# EAGLE design RelayWingTester (EAGLE 9.0.1)
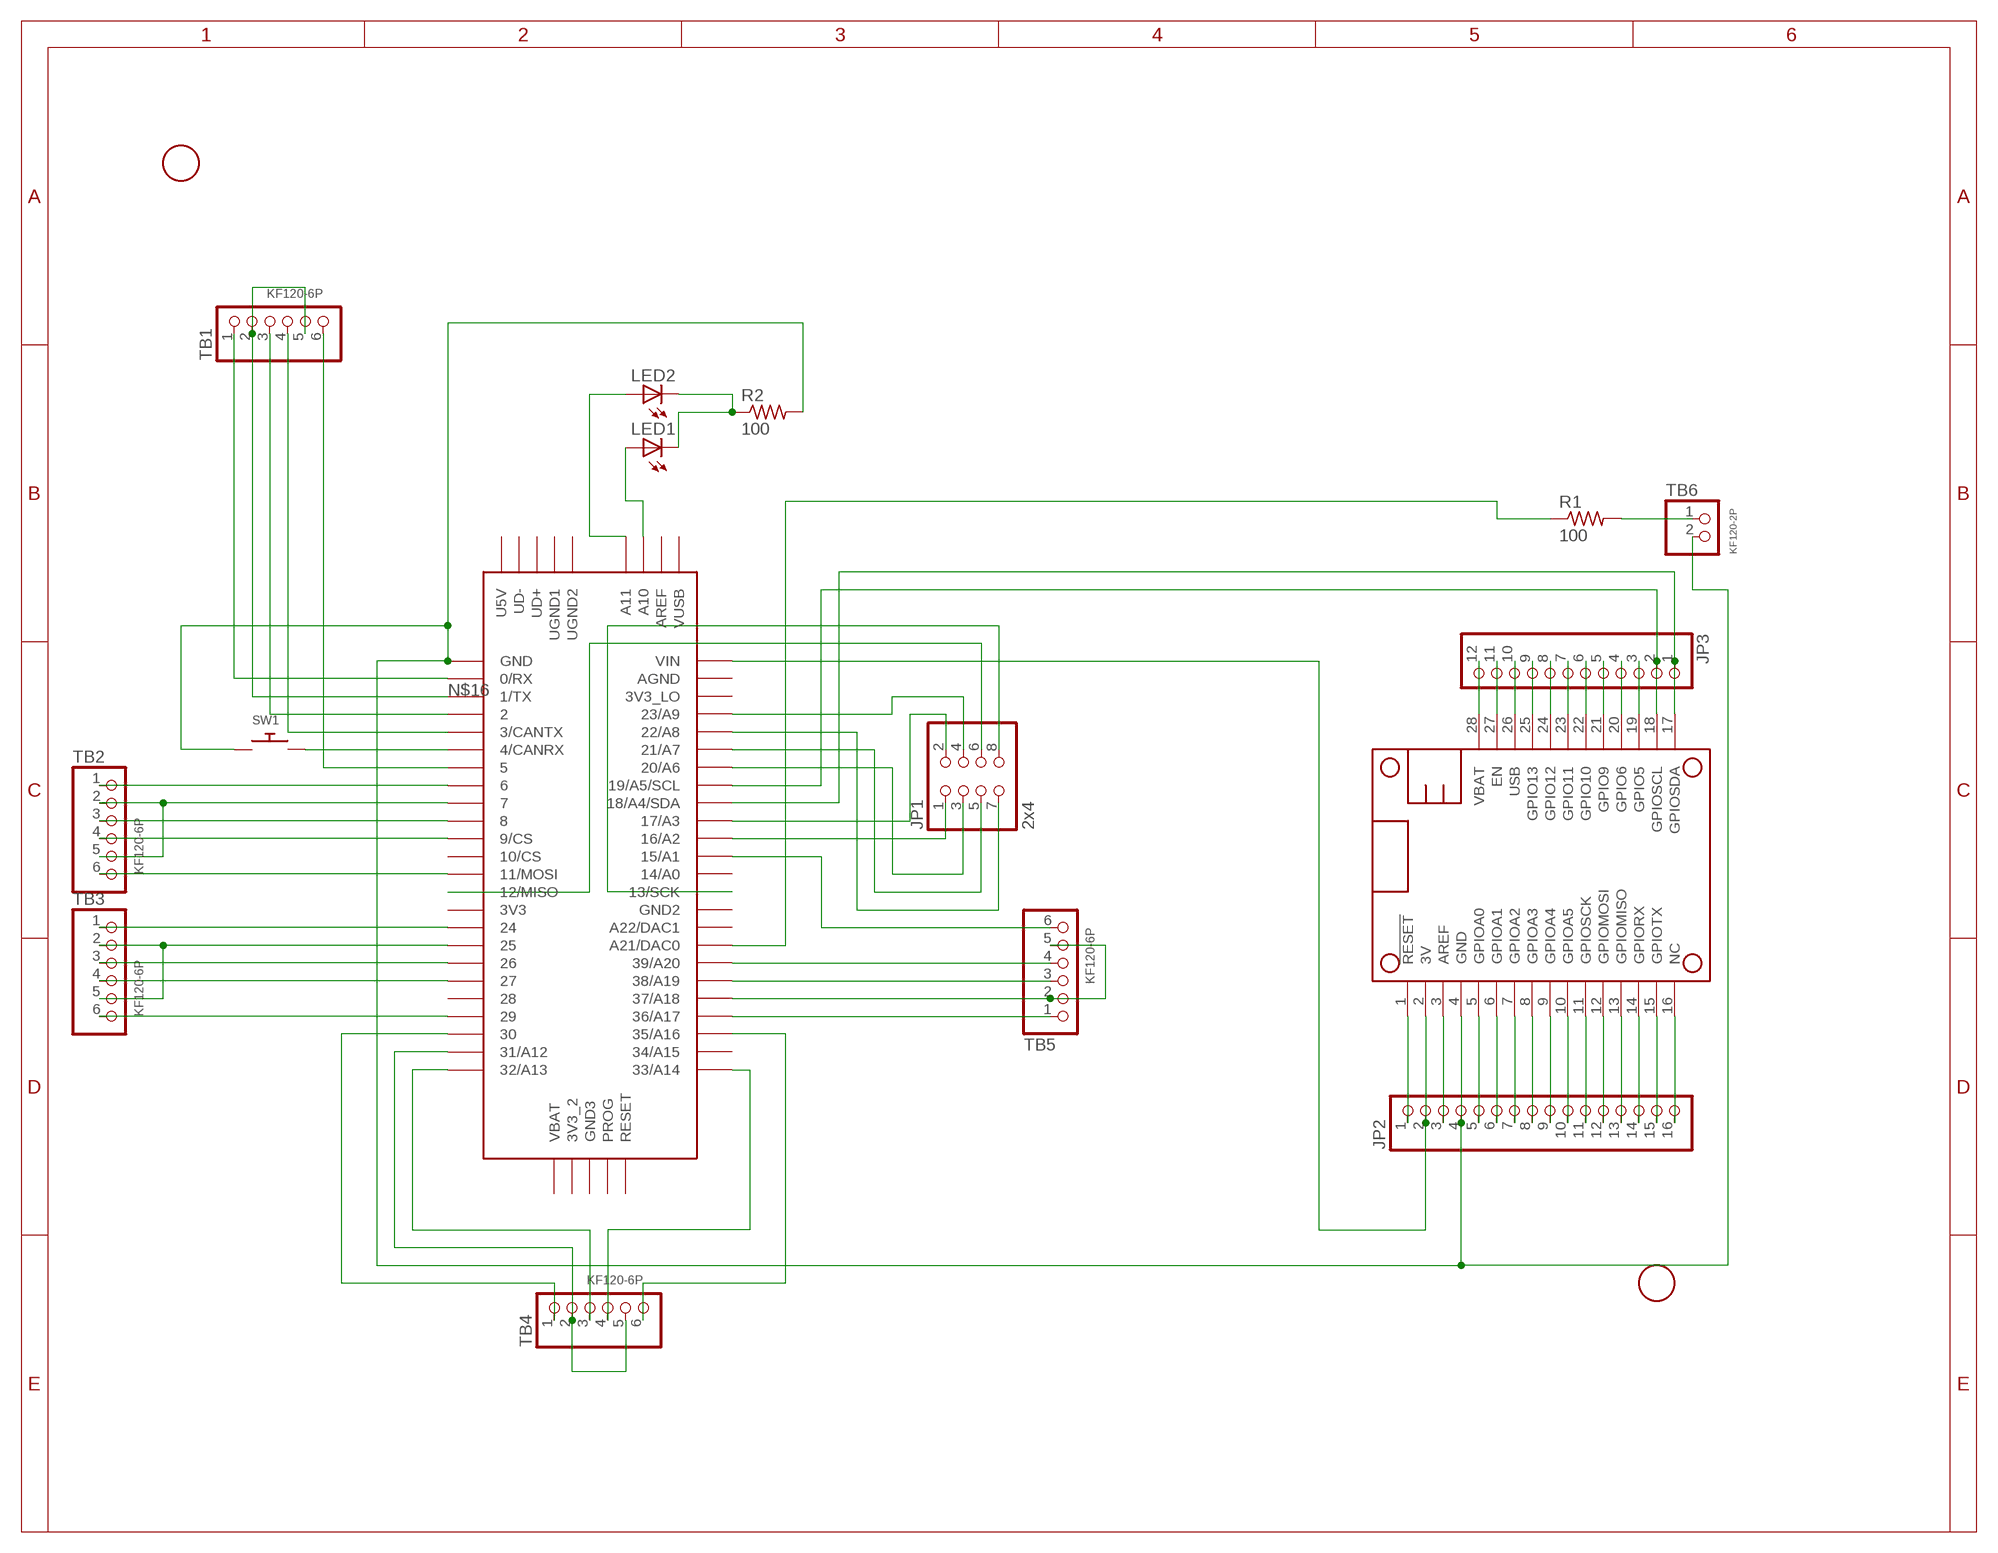
[diagram p0: schematic, sheet 1]

## Parts
JP1  2x4  PINHD-2X4  [2X04]
JP2  PINHD-1X16  [1X16]
JP3  PINHD-1X12  [1X12]
LED1  LED5MM  [LED5MM]
LED2  LED5MM  [LED5MM]
MS1  FEATHERWING_NODIM  [FEATHERWING_DIM]
R1  100  R-US_0207/10  [0207/10]
R2  100  R-US_0207/10  [0207/10]
SW1  SWITCH_PUSHBUTTONSOFTTOUCHSMD_SJ  [PUSHBUTTON_SMD_SJ]
TB1  KF120-6P  [KF120-6P_ROUND]
TB2  KF120-6P  [KF120-6P_ROUND]
TB3  KF120-6P  [KF120-6P_ROUND]
TB4  KF120-6P  [KF120-6P_ROUND]
TB5  KF120-6P  [KF120-6P_ROUND]
TB6  KF120-2P  [KF120-2P_ROUND]
U$2  FIDUCIAL  [FIDUCIAL_1MM]
U$3  FIDUCIAL  [FIDUCIAL_1MM]
U$4  TEENSY_3.5/3.6  [TEENSY_3.5/3.6]

## Nets
3V: JP2.2 MS1.2(3V) U$4.VIN
GND: JP2.4 MS1.4(GND) R2.2 SW1.P$1 TB6.2 U$4.GND
N$1: JP2.3 MS1.3(AREF)
N$2: JP3.1 MS1.17(GPIOSDA) U$4.18/A4/SDA
N$3: JP2.5 MS1.5(GPIOA0)
N$4: JP2.6 MS1.6(GPIOA1)
N$5: JP2.7 MS1.7(GPIOA2)
N$6: JP2.8 MS1.8(GPIOA3)
N$7: JP2.9 MS1.9(GPIOA4)
N$8: JP2.10 MS1.10(GPIOA5)
N$9: JP2.11 MS1.11(GPIOSCK)
N$10: JP2.12 MS1.12(GPIOMOSI)
N$11: JP2.13 MS1.13(GPIOMISO)
N$12: JP2.14 MS1.14(GPIORX)
N$13: JP2.15 MS1.15(GPIOTX)
N$14: JP2.16 MS1.16(NC)
N$15: JP3.3 MS1.19(GPIO5)
N$16: TB1.1 U$4.0/RX
N$17: TB1.2 TB1.5 U$4.1/TX
N$18: JP2.1 MS1.1(!RESET)
N$19: JP3.4 MS1.20(GPIO6)
N$20: JP3.5 MS1.21(GPIO9)
N$21: JP3.6 MS1.22(GPIO10)
N$22: JP3.7 MS1.23(GPIO11)
N$23: JP3.8 MS1.24(GPIO12)
N$24: TB1.3 U$4.2
N$25: TB1.4 U$4.3/CANTX
N$26: SW1.P$2 U$4.4/CANRX
N$27: TB1.6 U$4.5
N$28: TB2.1 U$4.6
N$29: TB2.2 TB2.5 U$4.7
N$30: TB2.3 U$4.8
N$31: TB2.4 U$4.9/CS
N$33: TB2.6 U$4.11/MOSI
N$34: TB3.1 U$4.24
N$35: TB3.2 TB3.5 U$4.25
N$36: TB3.3 U$4.26
N$37: TB3.4 U$4.27
N$39: TB3.6 U$4.29
N$40: TB4.1 U$4.30
N$41: TB4.2 TB4.5 U$4.31/A12
N$42: TB4.3 U$4.32/A13
N$43: TB4.4 U$4.33/A14
N$45: TB4.6 U$4.35/A16
N$46: TB5.1 U$4.36/A17
N$47: TB5.2 TB5.5 U$4.37/A18
N$48: TB5.3 U$4.38/A19
N$49: TB5.4 U$4.39/A20
N$51: JP3.9 MS1.25(GPIO13)
N$52: TB5.6 U$4.15/A1
N$53: R1.1 U$4.21/DAC0(A21/DAC0)
N$54: R1.2 TB6.1
N$55: JP1.1 U$4.16/A2
N$56: JP1.2 U$4.17/A3
N$57: JP1.3 U$4.20/A6
N$58: JP1.5 U$4.21/A7
N$59: JP1.7 U$4.22/A8
N$60: JP1.4 U$4.23/A9
N$61: JP3.11 MS1.27(EN)
N$62: JP1.6 U$4.12/MISO
N$63: JP1.8 U$4.13/SCK
N$64: LED2.A U$4.A11
N$65: LED1.A U$4.A10
N$66: LED1.K(C) LED2.K(C) R2.1
SCL: JP3.2 MS1.18(GPIOSCL) U$4.19/A5/SCL
USB: JP3.10 MS1.26(USB)
VBAT: JP3.12 MS1.28(VBAT)
Unconnected: U$4.3V3 U$4.3V3_2 U$4.3V3_LO U$4.10/CS U$4.14/A0 U$4.28 U$4.34/A15 U$4.A22/DAC1 U$4.AGND U$4.AREF U$4.GND2 U$4.GND3 U$4.PROG U$4.RESET U$4.U5V U$4.UD+ U$4.UD- U$4.UGND1 U$4.UGND2 U$4.VBAT U$4.VUSB

## Library data of the parts
JP1 = pinhead:PINHD-2X4: PIN HEADER
JP2 = pinhead:PINHD-1X16: PIN HEADER
JP3 = pinhead:PINHD-1X12: PIN HEADER
LED1 LED2 = adafruit:LED: LED OSRAM: - CHIPLED LG R971, LG N971, LY N971, LG Q971, LY Q971, LO R971, LY R971 LH N974, LH R974 LS Q976, LO Q976, LY Q976 LO Q996 - Hyper CHIPLED LW Q18S LB Q993, LB Q99A, LB R99A - SideLED LS A670, LO A670, LY A670, LG A670, LP A670 LB A673, LV A673, LT A673, LW A673 LH A674 LY A675 LS A676, LA A676, LO A676, LY A676, LW A676 LS A679, LY A679, LG A679 - Hyper Micro SIDELED® LS Y876, LA Y876, LO Y876, LY Y876 LT Y87S - SmartLED LW L88C, LW L88S LB L89C, LB L89S, LG L890 LS L89K, LO L89K, LY L89K LS L896, LA L896, LO L896, LY L896 - TOPLED LS T670, LO T670, LY T670, LG T670, LP T670 LSG T670, LSP T670, LSY T670, LOP T670, LYG T670 LG T671, LOG T671, LSG T671 LB T673, LV T673, LT T673, LW T673 LH T674 LS T676, LA T676, LO T676, LY T676, LB T676, LH T676, LSB T676, LW T676 LB T67C, LV T67C, LT T67C, LS T67K, LO T67K, LY T67K, LW E67C LS E67B, LA E67B, LO E67B, LY E67B, LB E67C, LV E67C, LT E67C LW T67C LS T679, LY T679, LG T679 LS T770, LO T770, LY T770, LG T770, LP T770 LB T773, LV T773, LT T773, LW T773 LH T774 LS E675, LA E675, LY E675, LS T675 LS T776, LA T776, LO T776, LY T776, LB T776 LHGB T686 LT T68C, LB T68C - Hyper Mini TOPLED® LB M676 - Mini TOPLED Santana® LG M470 LS M47K, LO M47K, LY M47K Source: http://www.osram.convergy.de/
MS1 = microbuilder:FEATHERWING
R1 = resistor:R-US_: RESISTOR, American symbol
R2 = adafruit:R-US_: RESISTOR, American symbol
SW1 = adafruit:SWITCH_PUSHBUTTON: Buttons SOFTTOUCHSMD_SJ - Soft touch temporary push button (Super Junk Akihabara) Compatible with SKPMANE010 [Mouser: 688-SKPMAN] C&K_KSS = Digikey: KSS221GLFS
TB1-TB5 = home:KF120-6P: Kaweei KF120-6P 6-pin screw terminalblock, 0.1" spacing. Adafruit
TB6 = home:KF120-2P: Kaweei KF120-2P 2-pin screw terminal block, 0.1" spacing. Through-hole. Adafruit
U$2 U$3 = adafruit:FIDUCIAL: For use by pick and place machines to calibrate the vision/machine, 1mm By microbuilder.eu
U$4 = Teensy356:TEENSY_3.5/3.6

## Net classes
0 default: width 0.203 mm, clearance 0.203 mm
1 2A: width 0.406 mm, clearance 0.203 mm
2 coils 200mA: width 0.203 mm, clearance 0.203 mm

## Board
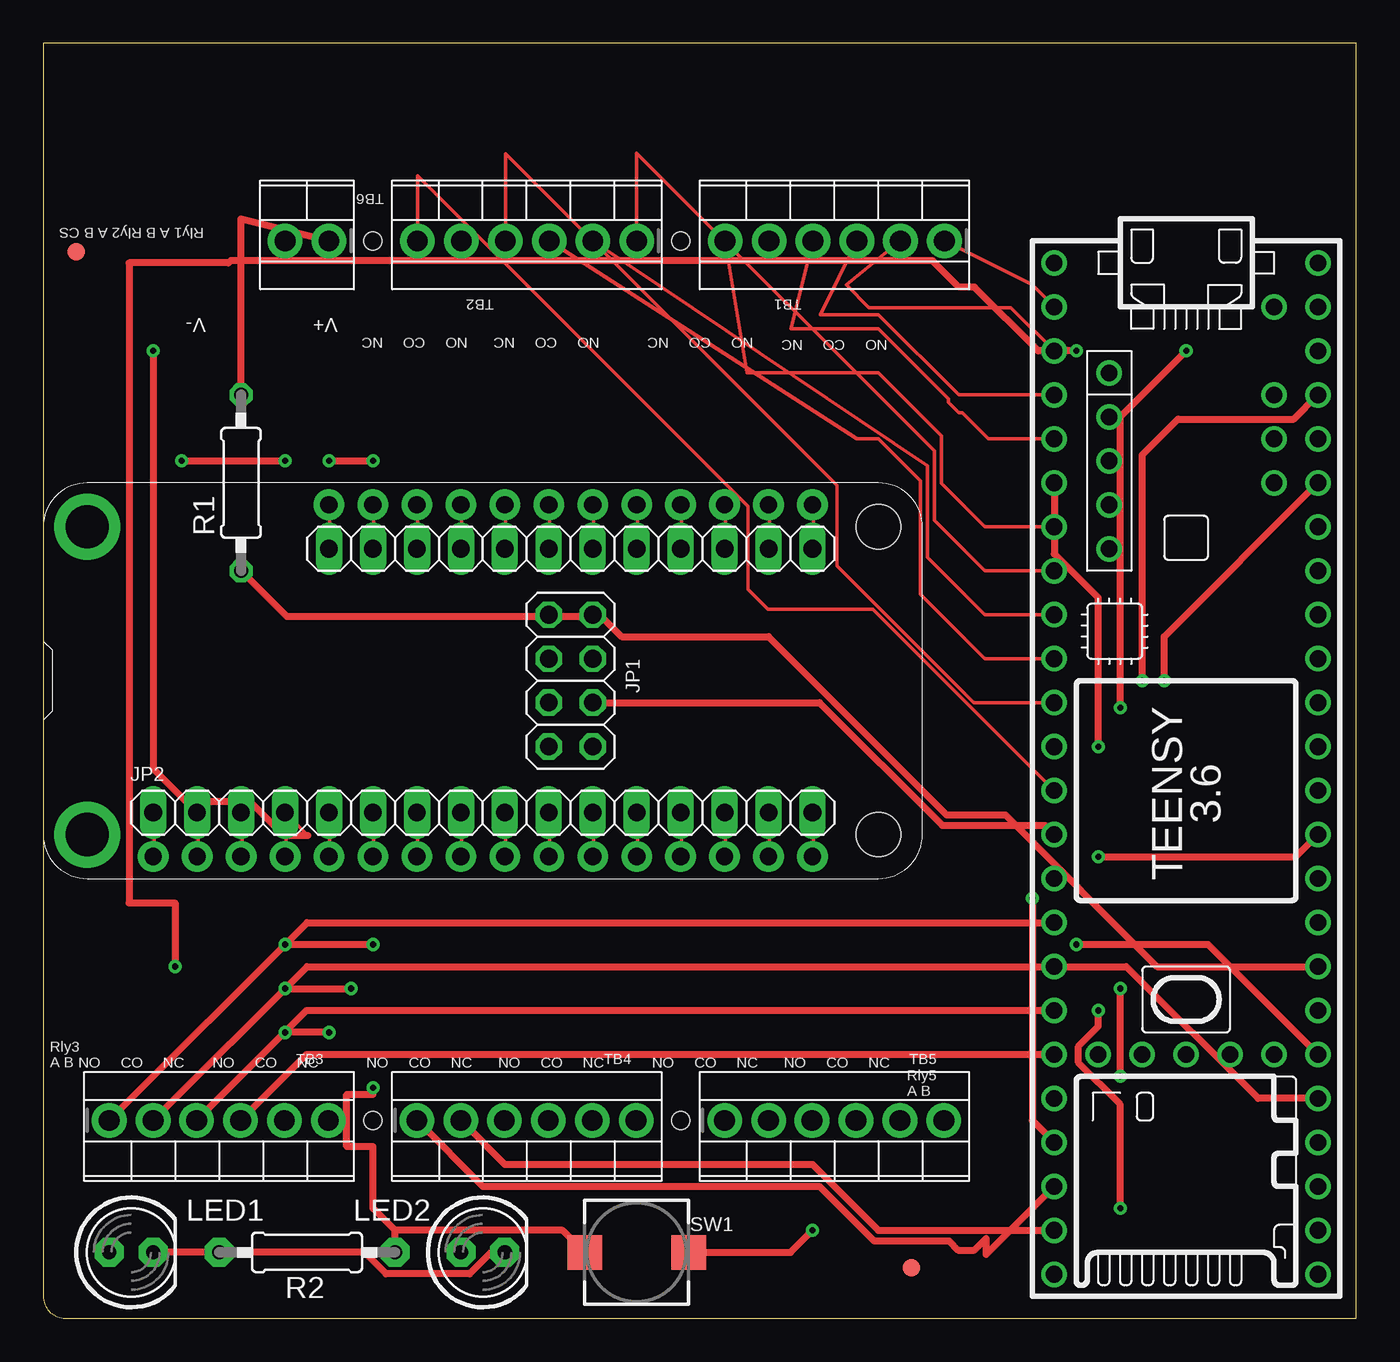
[diagram p1: board, top side]
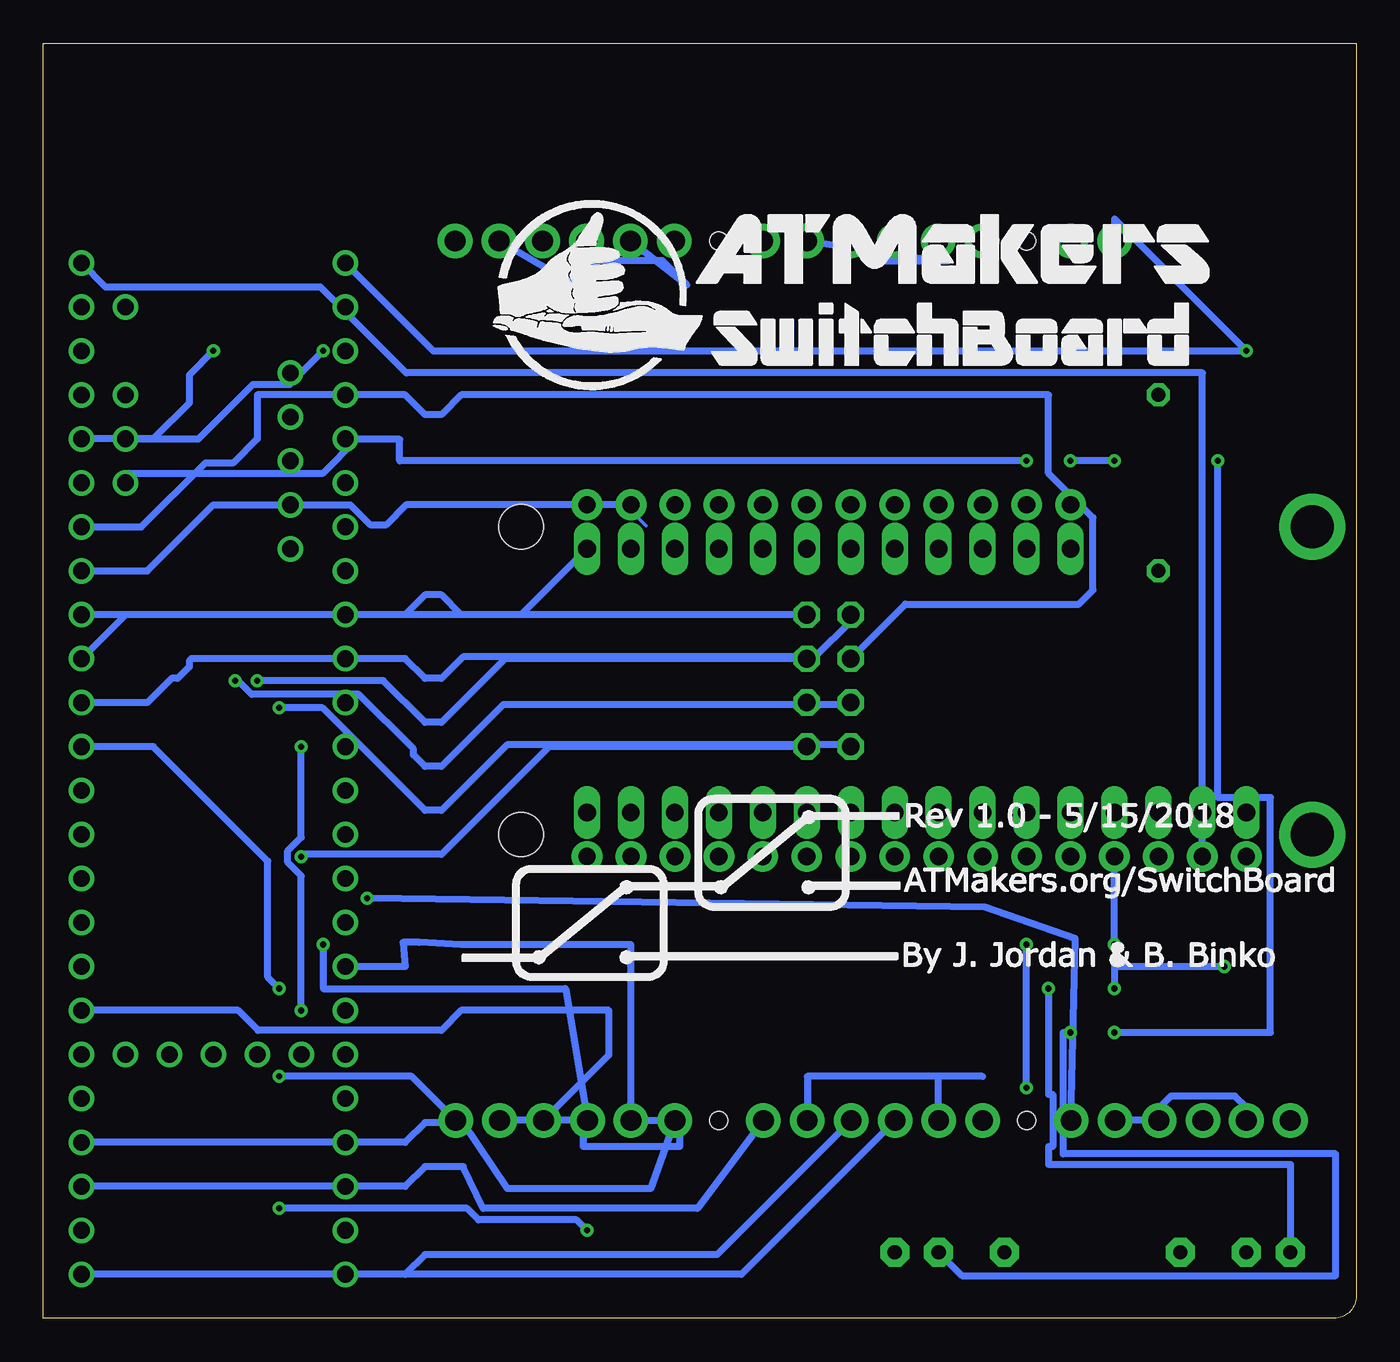
[diagram p2: board, bottom side, seen from below]

Size 75.87 x 73.65 mm. Coordinates in mm from the lower left corner, seen from the top.
Outline: 75.87,73.65 0,73.65 0,1.27 arc90 1.27,0 75.87,0 75.87,73.65
Copper layers (1*16): Top 0.035mm / dielectric 1.5mm / Bottom 0.035mm
Design rules "default": minimum track width 6mil, minimum drill 0.35mm, track to track 6mil, track to pad 6mil, pad to pad 6mil, via to via 6mil, smd to smd 6mil, copper to edge 40mil, drill to drill 6mil, minimum pad ring 10mil, minimum via ring 8mil, stop-mask expansion 4mil, vias tented up to drill 0mil, thermal gap 10mil
Holes 1.02 mm at 19.05,62.23 36.83,62.23 19.05,11.43 36.83,11.43
bRestrict: area 6.7,55.2 to 7.2,56.5; area 2.9,55.2 to 3.4,56.5
vRestrict: area 4.6,64.8 to 8,66; area 1.3,55.2 to 3.8,56.5; area 5.1,55.2 to 7.6,56.5; area 5.8,58.3 to 7,59.3; area 2,58.4 to 3.3,59.3

### Footprints (pad centres in the part's own frame; a part is rotated, then mirrored left to right if it is on the bottom)
2X04 = drill 1.016 octagon: 1 -3.81,-1.27; 2 -3.81,1.27; 3 -1.27,-1.27; 4 -1.27,1.27; 5 1.27,-1.27; 6 1.27,1.27; 7 3.81,-1.27; 8 3.81,1.27
1X16 = drill 1.016 long: 1 -19.05,0; 2 -16.51,0; 3 -13.97,0; 4 -11.43,0; 5 -8.89,0; 6 -6.35,0; 7 -3.81,0; 8 -1.27,0; 9 1.27,0; 10 3.81,0; 11 6.35,0; 12 8.89,0; 13 11.43,0; 14 13.97,0; 15 16.51,0; 16 19.05,0
1X12 = drill 1.016 long: 1 -13.97,0; 2 -11.43,0; 3 -8.89,0; 4 -6.35,0; 5 -3.81,0; 6 -1.27,0; 7 1.27,0; 8 3.81,0; 9 6.35,0; 10 8.89,0; 11 11.43,0; 12 13.97,0
LED5MM = drill 0.813 pad 1.676 octagon: A -1.27,0; K 1.27,0
FEATHERWING_DIM = drill 1 pad 1.778: 1 6.35,1.27; 2 8.89,1.27; 3 11.43,1.27; 4 13.97,1.27; 5 16.51,1.27; 6 19.05,1.27; 7 21.59,1.27; 8 24.13,1.27; 9 26.67,1.27; 10 29.21,1.27; 11 31.75,1.27; 12 34.29,1.27; 13 36.83,1.27; 14 39.37,1.27; 15 41.91,1.27; 16 44.45,1.27; 17 44.45,21.59; 18 41.91,21.59; 19 39.37,21.59; 20 36.83,21.59; 21 34.29,21.59; 22 31.75,21.59; 23 29.21,21.59; 24 26.67,21.59; 25 24.13,21.59; 26 21.59,21.59; 27 19.05,21.59; 28 16.51,21.59 | drill 2.5 pad 3.81: P$1 2.54,20.32; P$2 2.54,2.54 | hole 2.54: 48.26,20.32; 48.26,2.54
0207/10 = drill 0.813 octagon: 1 -5.08,0; 2 5.08,0
0207/10' = drill 0.813 pad 1.676 octagon: 1 -5.08,0; 2 5.08,0
PUSHBUTTON_SMD_SJ = smd 2 x 2: P$1 3,0; P$2 -3,0
KF120-6P_ROUND = drill 1.2 pad 2: 1 -6.35,0; 2 -3.81,0; 3 -1.3,0; 4 1.24,0; 5 3.78,0; 6 6.32,0
KF120-2P_ROUND = drill 1.2 pad 2: 1 -1.27,0; 2 1.27,0
FIDUCIAL_1MM = smd 1 x 1: 1 0,0
TEENSY_3.5/3.6 = drill 0.965: 0/RX -25.4,-7.62; 1/TX -22.86,-7.62; 2 -20.32,-7.62; 3/CANTX -17.78,-7.62; 3V3 7.62,-7.62; 3V3_2 17.78,-2.54; 3V3_LO -22.86,7.62; 4/CANRX -15.24,-7.62; 5 -12.7,-7.62; 6 -10.16,-7.62; 7 -7.62,-7.62; 8 -5.08,-7.62; 9/CS -2.54,-7.62; 10/CS 0,-7.62; 11/MOSI 2.54,-7.62; 12/MISO 5.08,-7.62; 13/SCK 5.08,7.62; 14/A0 2.54,7.62; 15/A1 0,7.62; 16/A2 -2.54,7.62; 17/A3 -5.08,7.62; 18/A4/SDA -7.62,7.62; 19/A5/SCL -10.16,7.62; 20/A6 -12.7,7.62; 21/A7 -15.24,7.62; 21/DAC0 12.7,7.62; 22/A8 -17.78,7.62; 23/A9 -20.32,7.62; 24 10.16,-7.62; 25 12.7,-7.62; 26 15.24,-7.62; 27 17.78,-7.62; 28 20.32,-7.62; 29 22.86,-7.62; 30 25.4,-7.62; 31/A12 27.94,-7.62; 32/A13 30.48,-7.62; 33/A14 30.48,7.62; 34/A15 27.94,7.62; 35/A16 25.4,7.62; 36/A17 22.86,7.62; 37/A18 20.32,7.62; 38/A19 17.78,7.62; 39/A20 15.24,7.62; A10 -17.78,5.08; A11 -15.24,5.08; A22/DAC1 10.16,7.62; AGND -25.4,7.62; AREF -20.32,5.08; GND -27.94,-7.62; GND2 7.62,7.62; GND3 17.78,0; PROG 17.78,2.54; RESET 17.78,5.08; U5V -21.59,-4.445; UD+ -16.51,-4.445; UD- -19.05,-4.445; UGND1 -13.97,-4.445; UGND2 -11.43,-4.445; VBAT 17.78,-5.08; VIN -27.94,7.62; VUSB -25.4,5.08

### Placement (x,y rotation side)
JP1  30.48,36.83 270 top
JP2  25.4,29.21 0 top
JP3  30.48,44.45 180 top
LED1  5.08,3.81 0 top
LED2  25.4,3.81 0 top
MS1  0,25.4 0 top
R1  11.43,48.26 90 top
R2  100  [0207/10']  15.24,3.81 0 top
SW1  34.29,3.81 180 top
TB1  45.72,62.23 180 top
TB2  27.94,62.23 180 top
TB3  10.16,11.43 0 top
TB4  27.94,11.43 0 top
TB5  45.72,11.43 0 top
TB6  15.24,62.23 180 top
U$2  1.91,61.59 0 top
U$3  50.16,2.92 0 top
U$4  66.04,33.02 270 top

### Tracks (layer width: path | path; a pad name or v marks a point on that pad's centre or on a via)
3V
  Top 0.203: JP2.2 8.94,29.16 8.94,26.72 MS1.2
  Bottom 0.406: MS1.2 8.89,54.61 54.9,54.61 59.85,59.56 72.26,59.56 U$4.VIN
GND  (via drill 0.35)
  Top 0.203: 14.02,27.89 14.02,26.72 MS1.4 | 15.29,27.89 JP2.4
  Top 0.406: v6.35,55.88 6.35,31.75 8.23,29.87 11.91,29.87 13.89,27.89 14.02,27.89 15.29,27.89 | v19.05,13.32 19.05,12.94 17.54,12.94 17.54,9.92 19.05,9.92 19.05,6.35 20.32,5.08 | v19.05,21.59 v13.97,21.59 | R2.2 20.32,5.08 | SW1.P$1 30.02,5.08 20.32,5.08
  Bottom 0.203: JP2.4 13.31,29.87
  Bottom 0.406: U$4.GND 53.34,55.88 v6.35,55.88 13.97,63.5 TB6.2 | v19.05,13.32 v19.05,21.59 | v13.97,21.59 MS1.4
N$1
  Top 0.203: JP2.3 11.48,29.16 11.48,26.72 MS1.3
N$2
  Top 0.203: MS1.17 44.5,46.94 44.5,44.5 JP3.1
  Bottom 0.406: JP3.1 48.26,40.64 51.72,40.64 52.87,41.78 53.81,41.78 54.96,40.64 U$4.18/A4/SDA
N$3
  Top 0.203: JP2.5 16.56,29.16 16.56,26.72 MS1.5
N$4
  Top 0.203: JP2.6 19.1,29.16 19.1,26.72 MS1.6
N$5
  Top 0.203: JP2.7 21.64,29.16 21.64,26.72 MS1.7
N$6
  Top 0.203: JP2.8 24.18,29.16 24.18,26.72 MS1.8
N$7
  Top 0.203: JP2.9 26.72,29.16 26.72,26.72 MS1.9
N$8
  Top 0.203: JP2.10 29.26,29.16 29.26,26.72 MS1.10
N$9
  Top 0.203: JP2.11 31.8,29.16 31.8,26.72 MS1.11
N$10
  Top 0.203: JP2.12 34.34,29.16 34.34,26.72 MS1.12
N$11
  Top 0.203: JP2.13 36.88,29.16 36.88,26.72 MS1.13
N$12
  Top 0.203: JP2.14 39.42,29.16 39.42,26.72 MS1.14
N$13
  Top 0.203: JP2.15 41.96,29.16 41.96,26.72 MS1.15
N$14
  Top 0.203: JP2.16 44.5,29.16 44.5,26.72 MS1.16
N$15
  Top 0.203: JP3.3 39.42,44.5 39.42,46.94 MS1.19
N$16
  Top 0.203: TB1.1 57.15,59.69 U$4.0/RX
N$17
  Top 0.203: TB1.2 46.41,59.69 47.72,58.38 55.91,58.38 U$4.1/TX
  Bottom 0.406: TB1.5 38.68,59.69 40.09,61.1 43.79,61.1 45.2,59.69 TB1.2
N$18
  Top 0.203: MS1.1 6.4,26.72 6.4,29.16 JP2.1
N$19
  Top 0.203: JP3.4 36.88,44.5 36.88,46.94 MS1.20
N$20
  Top 0.203: JP3.5 34.34,44.5 34.34,46.94 MS1.21
N$21
  Top 0.203: JP3.6 31.8,44.5 31.8,46.94 MS1.22
N$22
  Top 0.203: JP3.7 29.26,44.5 29.26,46.94 MS1.23
N$23
  Top 0.203: JP3.8 26.72,44.5 26.72,46.94 MS1.24
N$24
  Top 0.203: TB1.3 44.92,57.98 48.26,57.98 52.9,53.34 U$4.2
N$25
  Top 0.203: TB1.4 43.21,57.15 48.26,57.15 52.3,53.11 52.3,52.91 52.91,52.3 53.11,52.3 54.61,50.8 U$4.3/CANTX
N$26  (via drill 0.35)
  Top 0.406: SW1.P$2 43.18,3.81 v44.45,5.08 | v62.23,6.35 62.23,12.35 59.82,14.77 59.82,15.71 60.96,16.86 v60.96,17.78 | U$4.4/CANRX 58.42,44.16 60.96,41.62 v60.96,33.02
  Bottom 0.406: v44.45,5.08 45.06,5.69 50.73,5.69 51.39,6.35 v62.23,6.35 | v60.96,17.78 60.96,25.56 61.74,26.34 61.74,27 60.96,27.78 v60.96,33.02
N$27
  Top 0.203: TB1.6 40.67,54.61 48.26,54.61 51.89,50.98 51.89,48.23 54.41,45.72 U$4.5
N$28
  Top 0.203: TB2.1 34.29,67.31 51.49,50.11 51.49,46.1 54.41,43.18 U$4.6
N$29
  Top 0.203: TB2.2 51.08,49.25 51.08,43.97 54.41,40.64 U$4.7
  Bottom 0.406: 27.28,61.1 24.16,61.1 TB2.5 | TB2.2 24.27,61.1 23.58,61.1
N$30
  Top 0.203: TB2.3 47.02,50.8 48.26,50.8 50.67,48.39 50.67,41.83 54.41,38.1 U$4.8
N$31
  Top 0.203: TB2.4 26.7,67.28 45.87,48.11 45.87,43.46 53.77,35.56 U$4.9/CS
N$33
  Top 0.203: TB2.6 21.62,66.01 40.72,46.91 40.72,42.1 41.88,40.95 47.95,40.95 U$4.11/MOSI
N$34
  Top 0.406: TB3.1 15.24,22.86 U$4.24
N$35
  Top 0.406: TB3.2 15.24,20.32 U$4.25
  Bottom 0.406: TB3.2 6.35,12.18 7.01,12.84 10.71,12.84 12.12,11.43 TB3.5
N$36
  Top 0.406: TB3.3 15.21,17.78 U$4.26
N$37
  Top 0.406: TB3.4 15.21,15.24 U$4.27
N$39  (via drill 0.35)
  Top 0.406: v57.15,24.26 57.15,11.43 U$4.29
  Bottom 0.406: TB3.6 16.24,21.94 21.46,23.75 v57.15,24.26
N$40
  Top 0.406: TB4.1 25.4,7.62 44.86,7.62 48.01,4.47 52.33,4.47 52.87,3.94 53.81,3.94 54.48,4.61 54.48,3.68 U$4.30
N$41
  Top 0.406: TB4.2 26.67,8.89 44.45,8.89 48.26,5.08 U$4.31/A12
  Bottom 0.406: TB4.2 24.13,13.97 | 21.59,13.97 31.72,13.97 TB4.5
N$42
  Bottom 0.406: TB4.3 35.53,2.54 U$4.32/A13
N$43
  Bottom 0.406: U$4.33/A14 54.96,2.54 53.81,3.68 36.93,3.68 TB4.4
N$45
  Bottom 0.406: TB4.6 38.07,6.35 50.45,6.35 51.6,8.76 53.81,8.76 54.96,7.62 U$4.35/A16
N$46
  Bottom 0.406: U$4.36/A17 54.96,10.16 53.81,11.3 51.6,11.3 49.05,7.48 40.78,7.48 TB5.1
N$47  (via drill 0.35)
  Top 0.406: U$4.37/A18 70.2,12.7 62.58,20.32 v58.42,20.32
  Bottom 0.406: v58.42,20.32 54.96,20.32 55.08,21.72 54.14,21.72 51.72,21.59 41.91,21.59 TB5.2 39.1,11.43 39.1,9.92 44.66,9.92 44.66,11.43 TB5.5
N$48  (via drill 0.35)
  Top 0.406: U$4.38/A19 67.31,21.59 v59.69,21.59
  Bottom 0.406: v59.69,21.59 59.69,19.05 45.69,19.05 TB5.3
N$49
  Bottom 0.406: TB5.4 43.18,15.21 43.18,17.78 51.72,17.78 52.87,16.64 63.47,16.64 64.61,17.78 U$4.39/A20
N$51
  Top 0.203: JP3.9 24.18,44.5 24.18,46.94 MS1.25
N$52  (via drill 0.35)
  Top 0.406: v62.23,13.97 v62.23,19.05
  Bottom 0.406: TB5.6 54.58,13.97 v62.23,13.97 | v62.23,19.05 62.89,19.71 62.89,26.41 69.5,33.02 U$4.15/A1
N$53
  Top 0.406: U$4.21/DAC0 64.36,20.32 55.6,29.08 52.2,29.08 41.91,39.37 33.4,39.37 32.23,40.54 14.07,40.54 R1.1
N$54
  Top 0.406: R1.2 11.43,63.5 TB6.1
N$55
  Bottom 0.406: JP1.1 29.21,40.26 31.27,38.2 51.62,38.2 52.87,36.96 53.81,36.96 54.96,38.1 67.31,38.1 67.44,37.97 67.44,37.63 68.11,36.96 68.45,36.96 69.85,35.56 U$4.16/A2
N$56
  Bottom 0.406: JP1.2 71.12,40.64 U$4.17/A3
N$57
  Bottom 0.406: JP1.3 26.06,41.25 16.03,41.25 15.21,42.06 15.21,46.26 17.78,48.82 17.78,53.34 51.72,53.34 52.87,52.2 53.81,52.2 54.96,53.34 63.5,53.34 63.5,50.8 64.9,49.4 66.51,49.4 70.2,45.72 U$4.20/A6
N$58  (via drill 0.35)
  Top 0.406: v64.77,36.83 64.77,39.37 U$4.21/A7
  Bottom 0.406: JP1.5 29.31,35.46 49.28,35.46 52.87,31.88 53.81,31.88 54.48,32.55 54.48,32.89 57.63,36.05 63.83,36.05 64.61,36.83 v64.77,36.83
N$59  (via drill 0.35)
  Top 0.406: v62.23,35.26 62.23,52.07 v66.04,55.88
  Bottom 0.406: JP1.7 29.31,33.12 49.08,33.12 52.87,29.34 53.81,29.34 59.74,35.26 v62.23,35.26 | v66.04,55.88 67.44,54.48 67.44,52.87 69.5,50.8 U$4.22/A8
N$60  (via drill 0.35)
  Top 0.406: U$4.23/A9 72.26,51.94 65.57,51.94 63.5,49.88 v63.5,36.83
  Bottom 0.406: JP1.4 49.18,38.1 52.87,34.42 53.81,34.42 56.23,36.83 v63.5,36.83
N$61
  Top 0.203: JP3.11 19.1,44.5 19.1,46.94 MS1.27
N$62
  Top 0.406: JP1.6 44.86,35.56 51.94,28.47 57.89,28.47 U$4.12/MISO
N$63  (via drill 0.35)
  Top 0.406: v60.96,26.67 72.39,26.67 U$4.13/SCK
  Bottom 0.406: JP1.8 46.64,33.02 52.87,26.8 60.83,26.8 v60.96,26.67
N$64  (via drill 0.35)
  Top 0.406: v16.51,16.51 v13.97,16.51 | v8,49.53 v13.97,49.53 | v16.51,49.53 v19.05,49.53
  Bottom 0.406: v16.51,16.51 16.93,16.51 16.93,9.5 1.19,9.5 1.19,2.46 22.78,2.46 LED2.A | v8,49.53 8,30.07 4.95,30.07 4.95,16.51 v13.97,16.51 | v13.97,49.53 v16.51,49.53 | v19.05,49.53 55.27,49.53 55.27,50.77 57.76,50.77 59.74,48.79 71.12,48.79 U$4.A11
N$65  (via drill 0.35)
  Top 0.406: v59.69,55.88 57.5,55.88 53.81,59.56 52.91,59.56 51.38,61.1 10.85,61.1 10.71,60.96 4.95,60.96 4.95,24 7.62,24 v7.62,20.32 | v13.97,19.05 v17.78,19.05
  Bottom 0.406: U$4.A10 66.9,50.8 63.75,53.95 61.62,53.95 v59.69,55.88 | v7.62,20.32 13.97,20.32 v13.97,19.05 | v17.78,19.05 17.78,12.94 17.54,12.94 17.54,9.92 17.78,9.92 17.78,8.89 3.81,8.89 LED1.A
N$66
  Top 0.406: LED1.K R2.1 18.56,3.81 19.8,2.56 24.65,2.56 25.89,3.81 LED2.K
SCL
  Top 0.203: MS1.18 41.96,46.94 41.96,44.5 JP3.2
  Bottom 0.203: MS1.18 41.91,46.63 41.05,45.77
  Bottom 0.406: U$4.19/A5/SCL 69.85,43.18 66.04,46.99 58.13,46.99 56.99,45.85 56.04,45.85 54.87,47.02 41.94,47.02 MS1.18
USB
  Top 0.203: JP3.10 21.64,44.5 21.64,46.94 MS1.26
VBAT
  Top 0.203: JP3.12 16.56,44.5 16.56,46.94 MS1.28

### Text on the board
tPlace: Rly1 A B Rly2 A B CS | V- | V+ | NO CO NC | NO CO NC | NO CO NC | NO CO NC | Rly3 / A B | NO CO NC | NO CO NC | NO CO NC | NO CO NC | NO CO NC | NO CO NC | Rly5 / A B